# EAGLE design 3x3 test (EAGLE 8.3.2)
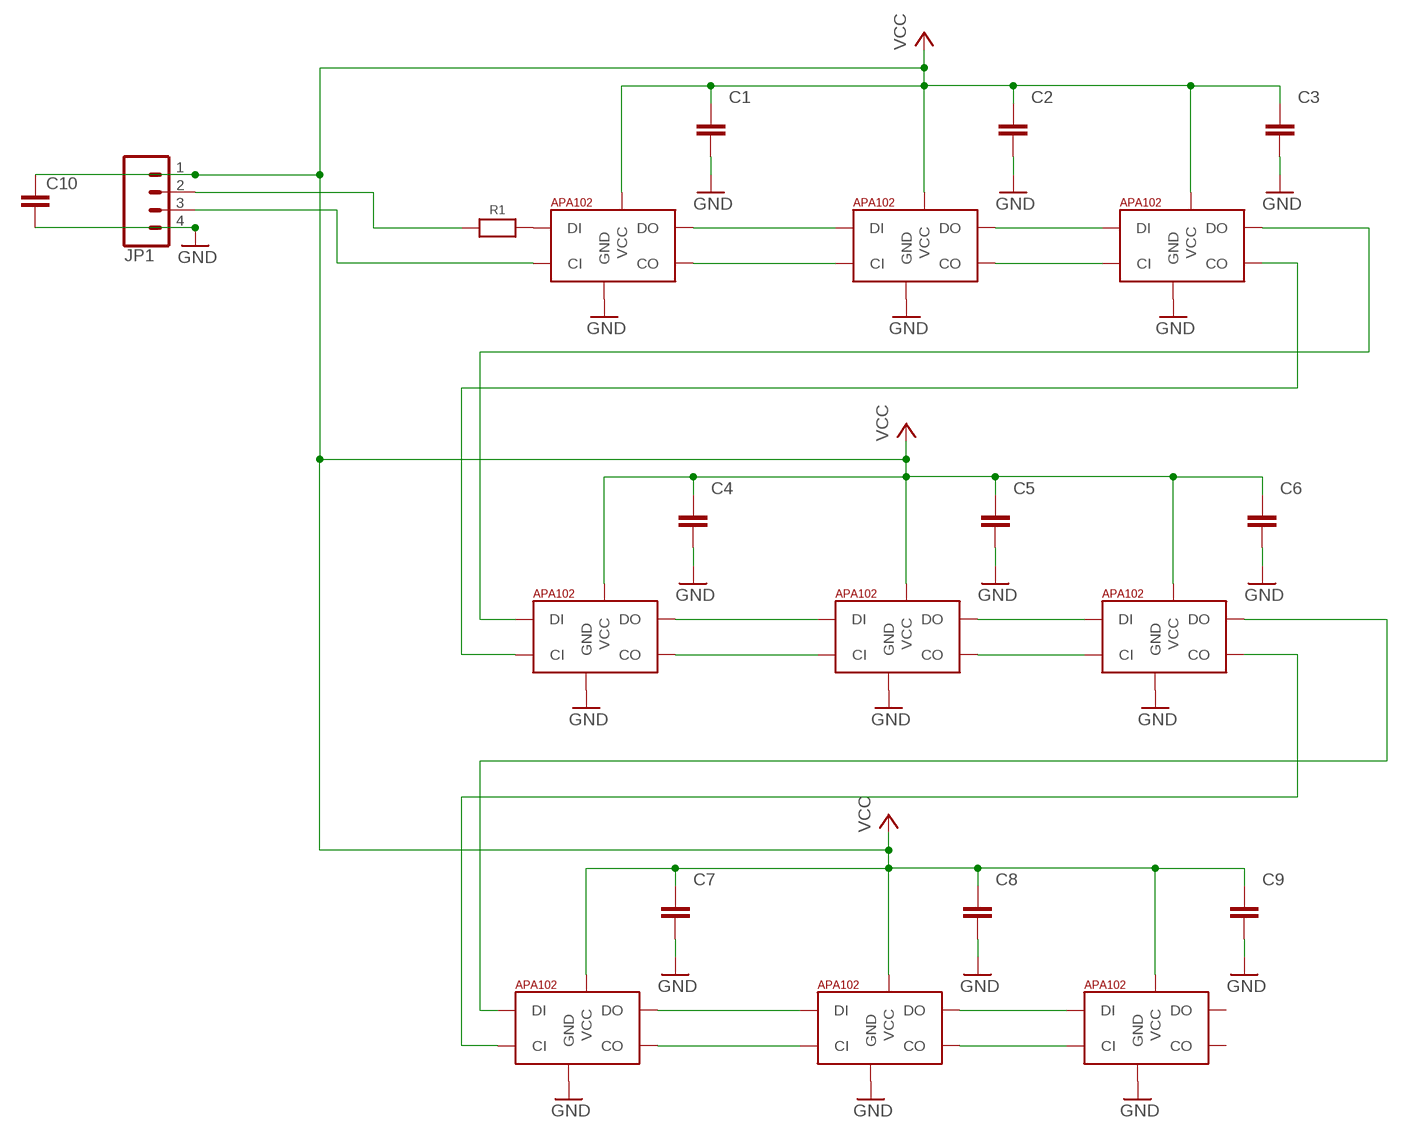
[diagram p0: schematic, sheet 1]

## Parts
C1  CAPACITOR_NPOL-0805  [C805]
C2  CAPACITOR_NPOL-0805  [C805]
C3  CAPACITOR_NPOL-0805  [C805]
C4  CAPACITOR_NPOL-0805  [C805]
C5  CAPACITOR_NPOL-0805  [C805]
C6  CAPACITOR_NPOL-0805  [C805]
C7  CAPACITOR_NPOL-0805  [C805]
C8  CAPACITOR_NPOL-0805  [C805]
C9  CAPACITOR_NPOL-0805  [C805]
C10  C-EUC0805  [C0805]
JP1  CONN_04  [1X04]
R1  RESISTOR0805_NOOUTLINE  [0805-NO]
U$1  APA1025050  [APA102_5050]
U$2  APA1025050  [APA102_5050]
U$3  APA1025050  [APA102_5050]
U$4  APA1025050  [APA102_5050]
U$5  APA1025050  [APA102_5050]
U$6  APA1025050  [APA102_5050]
U$7  APA1025050  [APA102_5050]
U$8  APA1025050  [APA102_5050]
U$9  APA1025050  [APA102_5050]

## Nets
GND: C1.2 C2.2 C3.2 C4.2 C5.2 C6.2 C7.2 C8.2 C9.2 C10.2 JP1.4 U$1.6(GND) U$2.6(GND) U$3.6(GND) U$4.6(GND) U$5.6(GND) U$6.6(GND) U$7.6(GND) U$8.6(GND) U$9.6(GND)
N$1: U$1.3(DO) U$2.4(DI)
N$2: U$2.3(DO) U$3.4(DI)
N$3: U$4.3(DO) U$5.4(DI)
N$4: U$5.3(DO) U$6.4(DI)
N$5: U$4.2(CO) U$5.5(CI)
N$6: U$5.2(CO) U$6.5(CI)
N$7: U$7.3(DO) U$8.4(DI)
N$8: U$8.3(DO) U$9.4(DI)
N$9: U$1.2(CO) U$2.5(CI)
N$10: U$2.2(CO) U$3.5(CI)
N$11: U$7.2(CO) U$8.5(CI)
N$12: U$8.2(CO) U$9.5(CI)
N$13: U$3.3(DO) U$4.4(DI)
N$14: U$3.2(CO) U$4.5(CI)
N$15: U$6.3(DO) U$7.4(DI)
N$16: U$6.2(CO) U$7.5(CI)
N$17: JP1.2 R1.1
N$18: R1.2 U$1.4(DI)
N$19: JP1.3 U$1.5(CI)
VCC: C1.1 C2.1 C3.1 C4.1 C5.1 C6.1 C7.1 C8.1 C9.1 C10.1 JP1.1 U$1.1(VCC) U$2.1(VCC) U$3.1(VCC) U$4.1(VCC) U$5.1(VCC) U$6.1(VCC) U$7.1(VCC) U$8.1(VCC) U$9.1(VCC)
Unconnected: U$9.2(CO) U$9.3(DO)

## Library data of the parts
C1-C9 = dp_devices:CAPACITOR_NPOL: Non-Polarized capacitor in various packages
C10 = rcl:C-EU: CAPACITOR, European symbol
JP1 = SparkFun-Connectors:CONN_04: Multi connection point. Often used as Generic Header-pin footprint for 0.1 inch spaced/style header connections On any of the 0.1 inch spaced packages, you can populate with these: Break Away Headers - Straight <https://www.sparkfun.com/products/116> (PRT-00116) Break Away Male Headers - Right Angle <https://www.sparkfun.com/products/553> (PRT-00553) Female Headers <https://www.sparkfun.com/products/115> (PRT-00115) Break Away Headers - Machine Pin <https://www.sparkfun.com/products/117> (PRT-00117) Break Away Female Headers - Swiss Machine Pin <https://www.sparkfun.com/products/743> (PRT-00743) For SCREWTERMINALS and SPRING TERMINALS visit here: Screw Terimnals on SparkFun.com <https://www.sparkfun.com/search/results?term=Screw+Terminals> (5mm/3.5mm/2.54mm spacing) This device is also useful as a general connection point to wire up your design to another part of your project. Our various solder wires solder well into these plated through hole pads. Hook-Up Wire - Assortment (Stranded, 22 AWG) <https://www.sparkfun.com/products/11375> (PRT-11375) Hook-Up Wire - Assortment (Solid Core, 22 AWG) <https://www.sparkfun.com/products/11367> (PRT-11367) View the entire wire category on our website here <https://www.sparkfun.com/categories/141> Special notes: Molex polarized connector foot print use with SKU : PRT-08231 with associated crimp pins and housings. 1MM SMD Version SKU: PRT-10208; PROD_ID: CONN-09696
R1 = microbuilder:RESISTOR: Resistors For new designs, use the packages preceded by an '_' character since they are more reliable: The following footprints should be used on most boards: _0402 - Standard footprint for regular board layouts _0603 - Standard footprint for regular board layouts _0805 - Standard footprint for regular board layouts _1206 - Standard footprint for regular board layouts For extremely tight-pitch boards where space is at a premium, the following 'micro-pitch' footprints can be used (smaller pads, no silkscreen outline, etc.): _0402MP - Micro-pitch footprint for very dense/compact boards _0603MP - Micro-pitch footprint for very dense/compact boards _0805MP - Micro-pitch footprint for very dense/compact boards _1206MP - Micro-pitch footprint for very dense/compact boards
U$1-U$9 = jos-ph:APA102: APA102C 5050 RGB LED -- Adafruit DotStar Single LED Pixel Product Page: https://www.adafruit.com/products/2343 Datasheet: https://cdn-shop.adafruit.com/product-files/2343/APA102C.pdf

## Board
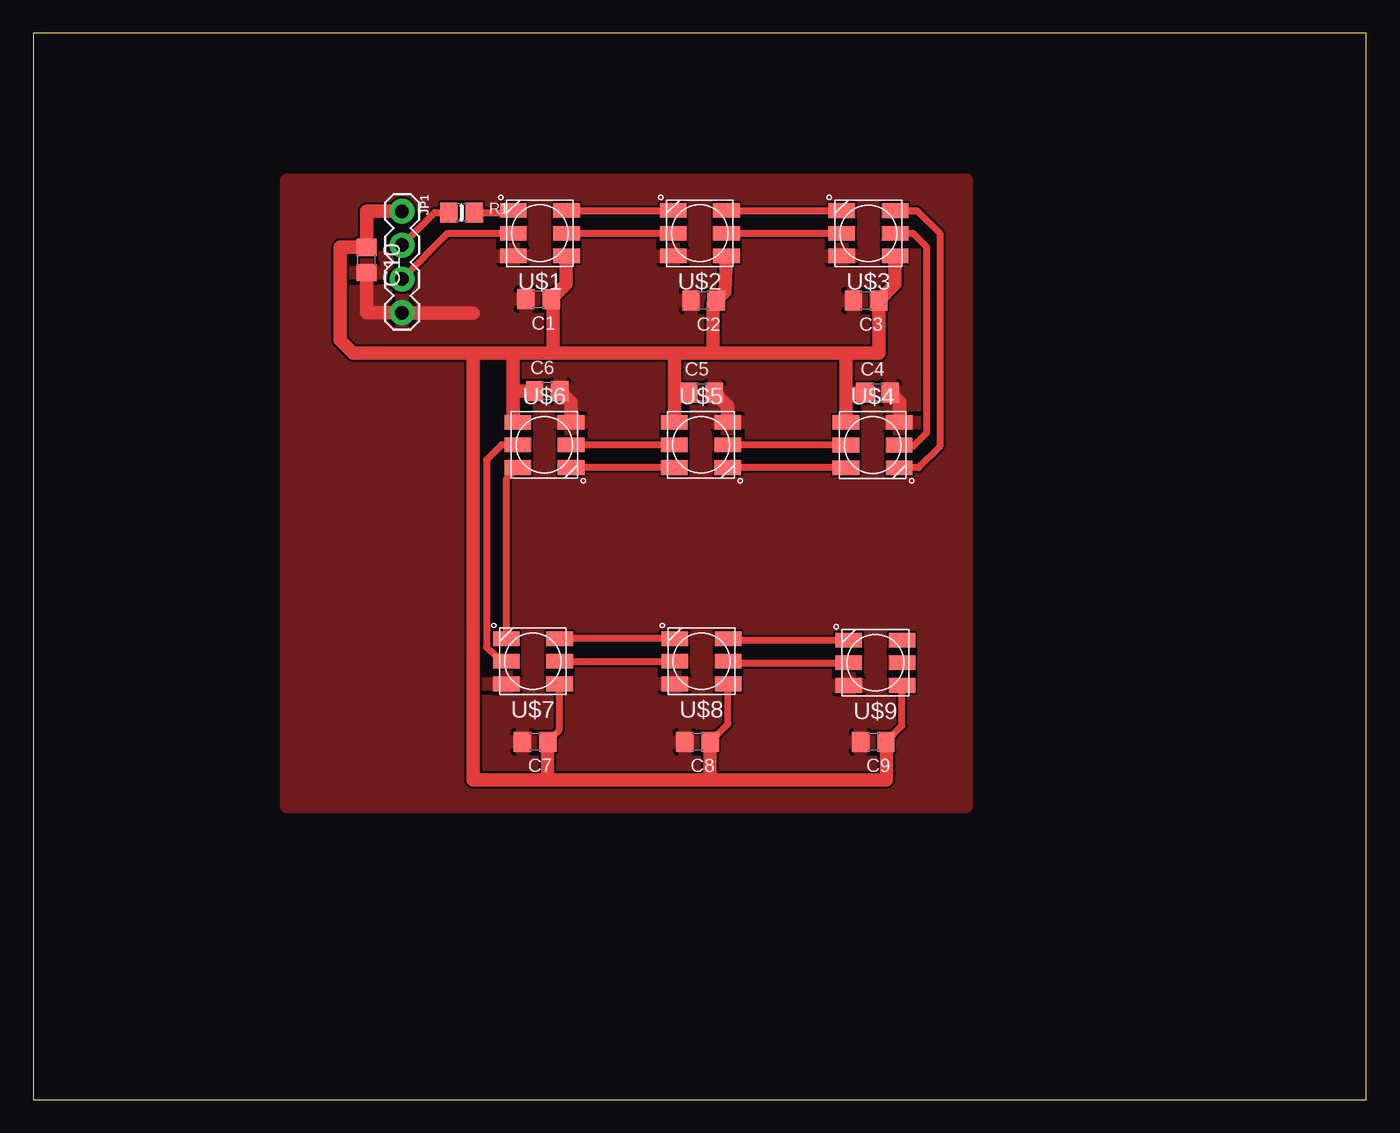
[diagram p1: board, top side]

Size 100 x 80 mm. Coordinates in mm from the lower left corner, seen from the top.
Outline: 0,0 100,0 100,80 0,80 0,0
Copper layers (1*16): Top 0.035mm / dielectric 1.5mm / Bottom 0.035mm
Design rules "default *": minimum track width 6mil, minimum drill 0.35mm, track to track 6mil, track to pad 6mil, pad to pad 6mil, via to via 6mil, smd to smd 6mil, copper to edge 40mil, drill to drill 6mil, minimum pad ring 10mil, minimum via ring 8mil, stop-mask expansion 4mil, vias tented up to drill 0mil, thermal gap 10mil

### Footprints (pad centres in the part's own frame; a part is rotated, then mirrored left to right if it is on the bottom)
C805 = smd 1.3 x 1.5: 1 -0.95,0; 2 0.95,0
C0805 = smd 1.3 x 1.5: 1 -0.95,0; 2 0.95,0
1X04 = drill 1.016 pad 1.88: 1 0,0; 2 2.54,0; 3 5.08,0; 4 7.62,0
0805-NO = smd 1.3 x 1.5: 1 -0.95,0; 2 0.95,0
APA102_5050 = smd 2 x 1.1: 1 2,-1.7; 2 2,0; 3 2,1.7; 4 -2,1.7; 5 -2,0; 6 -2,-1.7

### Placement (x,y rotation side)
C1  37.9,60.04 180 top
C2  50.29,59.96 180 top
C3  62.48,59.96 180 top
C4  63.33,53.04 0 top
C5  50.14,53.04 0 top
C6  38.55,53.15 0 top
C7  37.64,26.85 180 top
C8  49.83,26.85 180 top
C9  63.02,26.85 180 top
C10  25,63 270 top
JP1  27.66,66.65 270 top
R1  32.13,66.56 0 top
U$1  38,65 0 top
U$2  50,65 0 top
U$3  62.66,64.99 0 top
U$4  62.97,49.11 180 top
U$5  50.09,49.12 180 top
U$6  38.34,49.12 180 top
U$7  37.48,32.88 0 top
U$8  50.13,32.88 0 top
U$9  63.18,32.77 0 top

### Tracks (layer width: path | path; a pad name or v marks a point on that pad's centre or on a via)
GND
  Top 1.016: C10.2 25,59.03 JP1.4 27.69,59 33,59 | C6.2 40.34,52.3 U$6.6 | C5.2 52.09,52.03 U$5.6 | C4.2 64.97,52.35 U$4.6
  pour Top: 19,69 19,22 70,22 70,69
N$1
  Top 0.508: U$1.3 U$2.4
N$2
  Top 0.508: U$2.3 U$3.4
N$3
  Top 0.508: U$4.3 U$5.4
N$4
  Top 0.508: U$5.3 U$6.4
N$5
  Top 0.508: U$4.2 U$5.5
N$6
  Top 0.508: U$5.2 U$6.5
N$7
  Top 0.508: U$8.4 U$7.3
N$8
  Top 0.508: U$8.3 52.13,34.47 U$9.4
N$9
  Top 0.508: U$1.2 U$2.5
N$10
  Top 0.508: U$2.2 U$3.5
N$11
  Top 0.508: U$7.2 U$8.5
N$12
  Top 0.508: U$8.2 52.13,32.77 U$9.5
N$13
  Top 0.508: U$3.3 66.31,66.69 68,65 68,49 66.41,47.41 U$4.4
N$14
  Top 0.508: U$3.2 66.01,64.99 67,64 67,50 66,49 65.08,49 U$4.5
N$15
  Top 0.508: U$6.3 35.48,46.55 U$7.4
N$16
  Top 0.508: U$6.2 35.12,49.12 34,48 34,33.94 34.31,33.62 34.38,33.62 | 34.38,33.62 35,33 | U$7.5 35.12,32.88 34.38,33.62
N$17
  Top 0.508: JP1.2 30.11,66.56 R1.1
N$18
  Top 0.508: R1.2 35.85,66.56 U$1.4
N$19
  Top 0.508: 35.97,65 U$1.5 31.08,64.99 JP1.3
VCC
  Top 0.508: C7.1 39.48,27.74 U$7.1 | C8.1 52.13,28.2 U$8.1 | C9.1 65.18,28.06 U$9.1
  Top 1.016: JP1.1 25,66.65 C10.1 23,63.95 23,57 24,56 33,56 | 51,24 64,24 64,26.82 C9.1 | 51,24 50.78,24.22 C8.1 | 38.59,24 33,24 33,56 | 38.59,24 51,24 | 38.59,24 C7.1 | 51,56 61,56 | 51,56 48,56 | 61,56 63.43,56 C3.1 64.66,61.19 U$3.1 | 39,56 48,56 | 39,56 36,56 | 36,56 33,56 | 36,56 36,53 | 36,53 36,51.16 U$6.1 | 48,56 48.09,55.91 48.09,53 | U$5.1 48.09,53 | 60.97,53 60.97,55.97 61,56 | 60.97,53 U$4.1 | 36,53 36.15,53.15 C6.1 | C4.1 62.34,53 60.97,53 | U$2.1 51.91,60.62 C2.1 51,59.72 51,56 | 39,56 39,59.89 C1.1 39.98,61.17 39.98,63.28 U$1.1 | 48.09,53 48.13,53.04 C5.1